# EAGLE design Line_Sensor v1 (EAGLE 9.7.0)
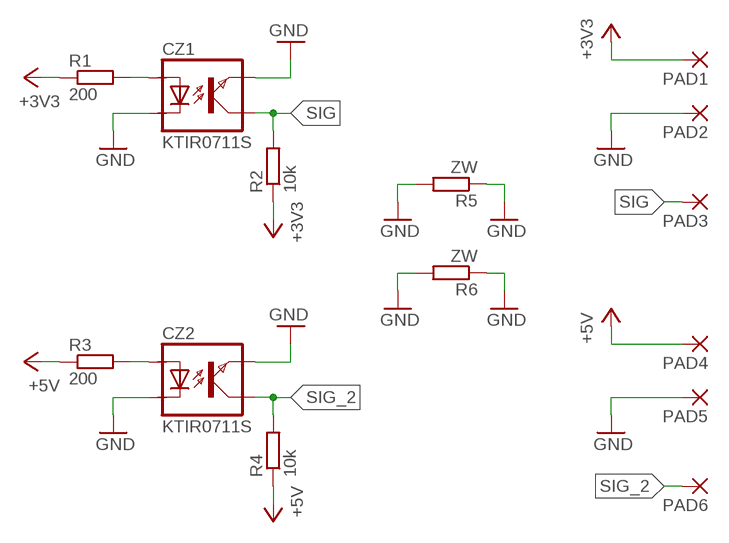
[diagram p0: schematic, sheet 1]

## Parts
CZ1  KTIR0711S  [TOP]
CZ2  KTIR0711S  [TOP]
PAD1  SMD5  [SMD2,54-5,08]
PAD2  SMD5  [SMD2,54-5,08]
PAD3  SMD5  [SMD2,54-5,08]
PAD4  SMD5  [SMD2,54-5,08]
PAD5  SMD5  [SMD2,54-5,08]
PAD6  SMD5  [SMD2,54-5,08]
R1  200  R-EU_R1206  [R1206]
R2  10k  R-EU_R1206  [R1206]
R3  200  R-EU_R1206  [R1206]
R4  10k  R-EU_R1206  [R1206]
R5  ZW  R-EU_R1206  [R1206]
R6  ZW  R-EU_R1206  [R1206]

## Nets
+3V3: PAD1.1(P) R1.1 R2.1
+5V: PAD4.1(P) R3.1 R4.1
GND: CZ1.EMITER CZ1.KATODA CZ2.EMITER CZ2.KATODA PAD2.1(P) PAD5.1(P) R5.1 R5.2 R6.1 R6.2
N$1: CZ1.ANODA R1.2
N$2: CZ2.ANODA R3.2
SIG: CZ1.KOLEKTOR PAD3.1(P) R2.2
SIG_2: CZ2.KOLEKTOR PAD6.1(P) R4.2

## Library data of the parts
CZ1 CZ2 = KTIR0711S:KTIR0711S
PAD1-PAD6 = wirepad:SMD5: SMD PAD
R1-R6 = rcl:R-EU_: RESISTOR, European symbol

## Board
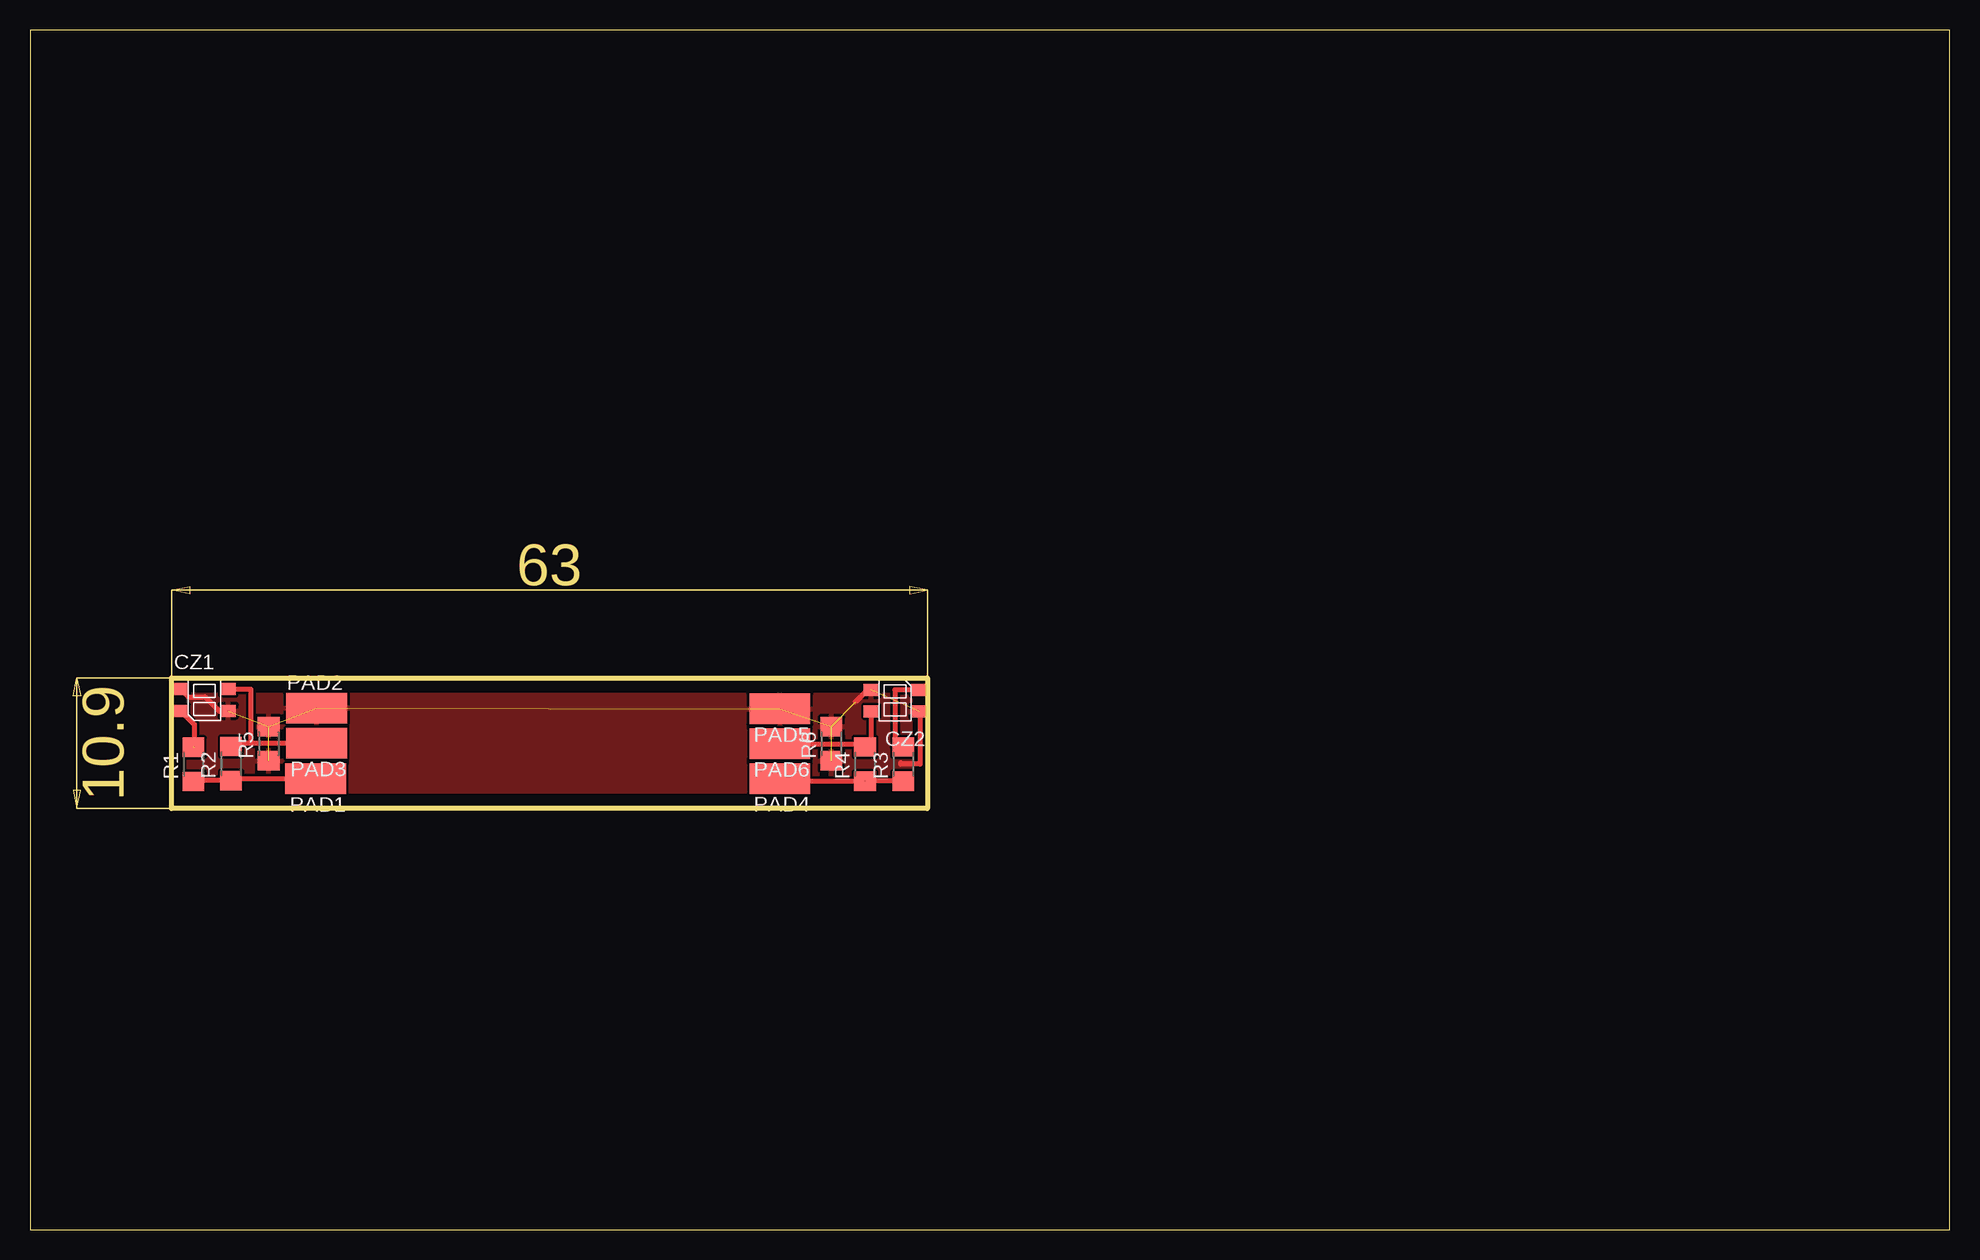
[diagram p1: board, top side]

Size 160 x 100 mm. Coordinates in mm from the lower left corner, seen from the top.
Outline: 0,0 160,0 160,100 0,100 0,0
Outline: 11.8,35.1 11.8,46 74.8,46 74.8,35.1 11.8,35.1
Copper layers (1*16): Top / Bottom
Stack-up Default Layer Stack: Top User Defined 0.035mm / Dielectric-1 User Defined 1.5mm / Bottom User Defined 0.035mm
Design rules: minimum copper width 10mil, minimum drill size 24mil, copper clearance wire_polygon to wire_polygon 8mil, copper clearance wire_polygon to pad_smd 8mil, copper clearance wire_polygon to via 8mil, copper clearance pad_smd to pad_smd 8mil, copper clearance pad_smd to via 8mil, copper clearance via to via 8mil, copper clearance smd to pad (same net) 8mil, copper clearance smd to via (same net) 8mil, copper clearance smd to smd (same net) 8mil, dimension clearance 40mil, via restrict clearance 0mil, restrict clearance 0mil, drill distance 8mil, keepout clearance 0mil

### Footprints (pad centres in the part's own frame; a part is rotated, then mirrored left to right if it is on the bottom)
TOP = smd 1.27 x 1: ANODA -1.985,-0.9; EMITER -1.985,0.9; KATODA 1.985,-0.9; KOLEKTOR 1.985,0.91
SMD2,54-5,08 = smd 2.54 x 5.08: 1 0,0
R1206 = smd 1.6 x 1.803: 1 -1.422,0; 2 1.422,0

### Placement (x,y rotation side)
CZ1  14.54,44.15 0 top
CZ2  72.1,44.1 180 top
PAD1  23.83,37.57 90 top
PAD2  23.88,43.47 270 top
PAD3  23.88,40.54 90 top
PAD4  62.5,37.6 90 top
PAD5  62.5,43.4 90 top
PAD6  62.5,40.5 90 top
R1  13.64,38.78 90 top
R2  16.76,38.84 90 top
R3  72.8,38.8 90 top
R4  69.6,38.8 90 top
R5  19.9,40.5 90 top
R6  66.8,40.5 90 top

### Tracks (layer width: path | path; a pad name or v marks a point on that pad's centre or on a via)
+3V3
  Top 0.406: PAD1.1 16.91,37.57 R2.1 13.7,37.42 R1.1
+5V  (1 unrouted)
  Top 0.406: PAD4.1 62.7,37.4 69.6,37.4 | R3.1 R4.1
GND  (9 unrouted)
  Top 0.406: CZ1.EMITER 13.21,44.4 14.6,44.4 15.8,43.2 16.6,43.2 | CZ2.EMITER 74.2,43.2 74.2,38.8 72.6,38.8 72.6,38.9 | CZ2.KATODA 69.8,45 68.8,44
  pour Top: 75,46.2 11.6,46.2 11.6,34.9 75,34.9
N$1  (1 unrouted)
  Top 0.406: CZ1.ANODA 13.7,42.1 13.7,40.2
N$2
  Top 0.406: CZ2.ANODA 72.1,45 72.1,40.2 72.8,40.2 R3.2
SIG
  Top 0.406: PAD3.1 18.4,40.54 | 18.4,40.54 16.94,40.54 R2.2 | CZ1.KOLEKTOR 18.4,45.06 18.4,40.54
SIG_2
  Top 0.406: PAD6.1 69.6,40.5 | 69.6,40.5 R4.2 | CZ2.KOLEKTOR 70.11,41.02 69.6,40.5